# EAGLE design XuDL (EAGLE 5.11)
AUTHOR: Dave Vandenbout / XESS Corp.; DIGIKEY#: 296-16843-1-ND; MANF: Xicon; MANF#: 301-5.1K-RC; MOUSER#: 301-5.1K-RC; VERSION#: 1.0

## Sheet 1 of 2
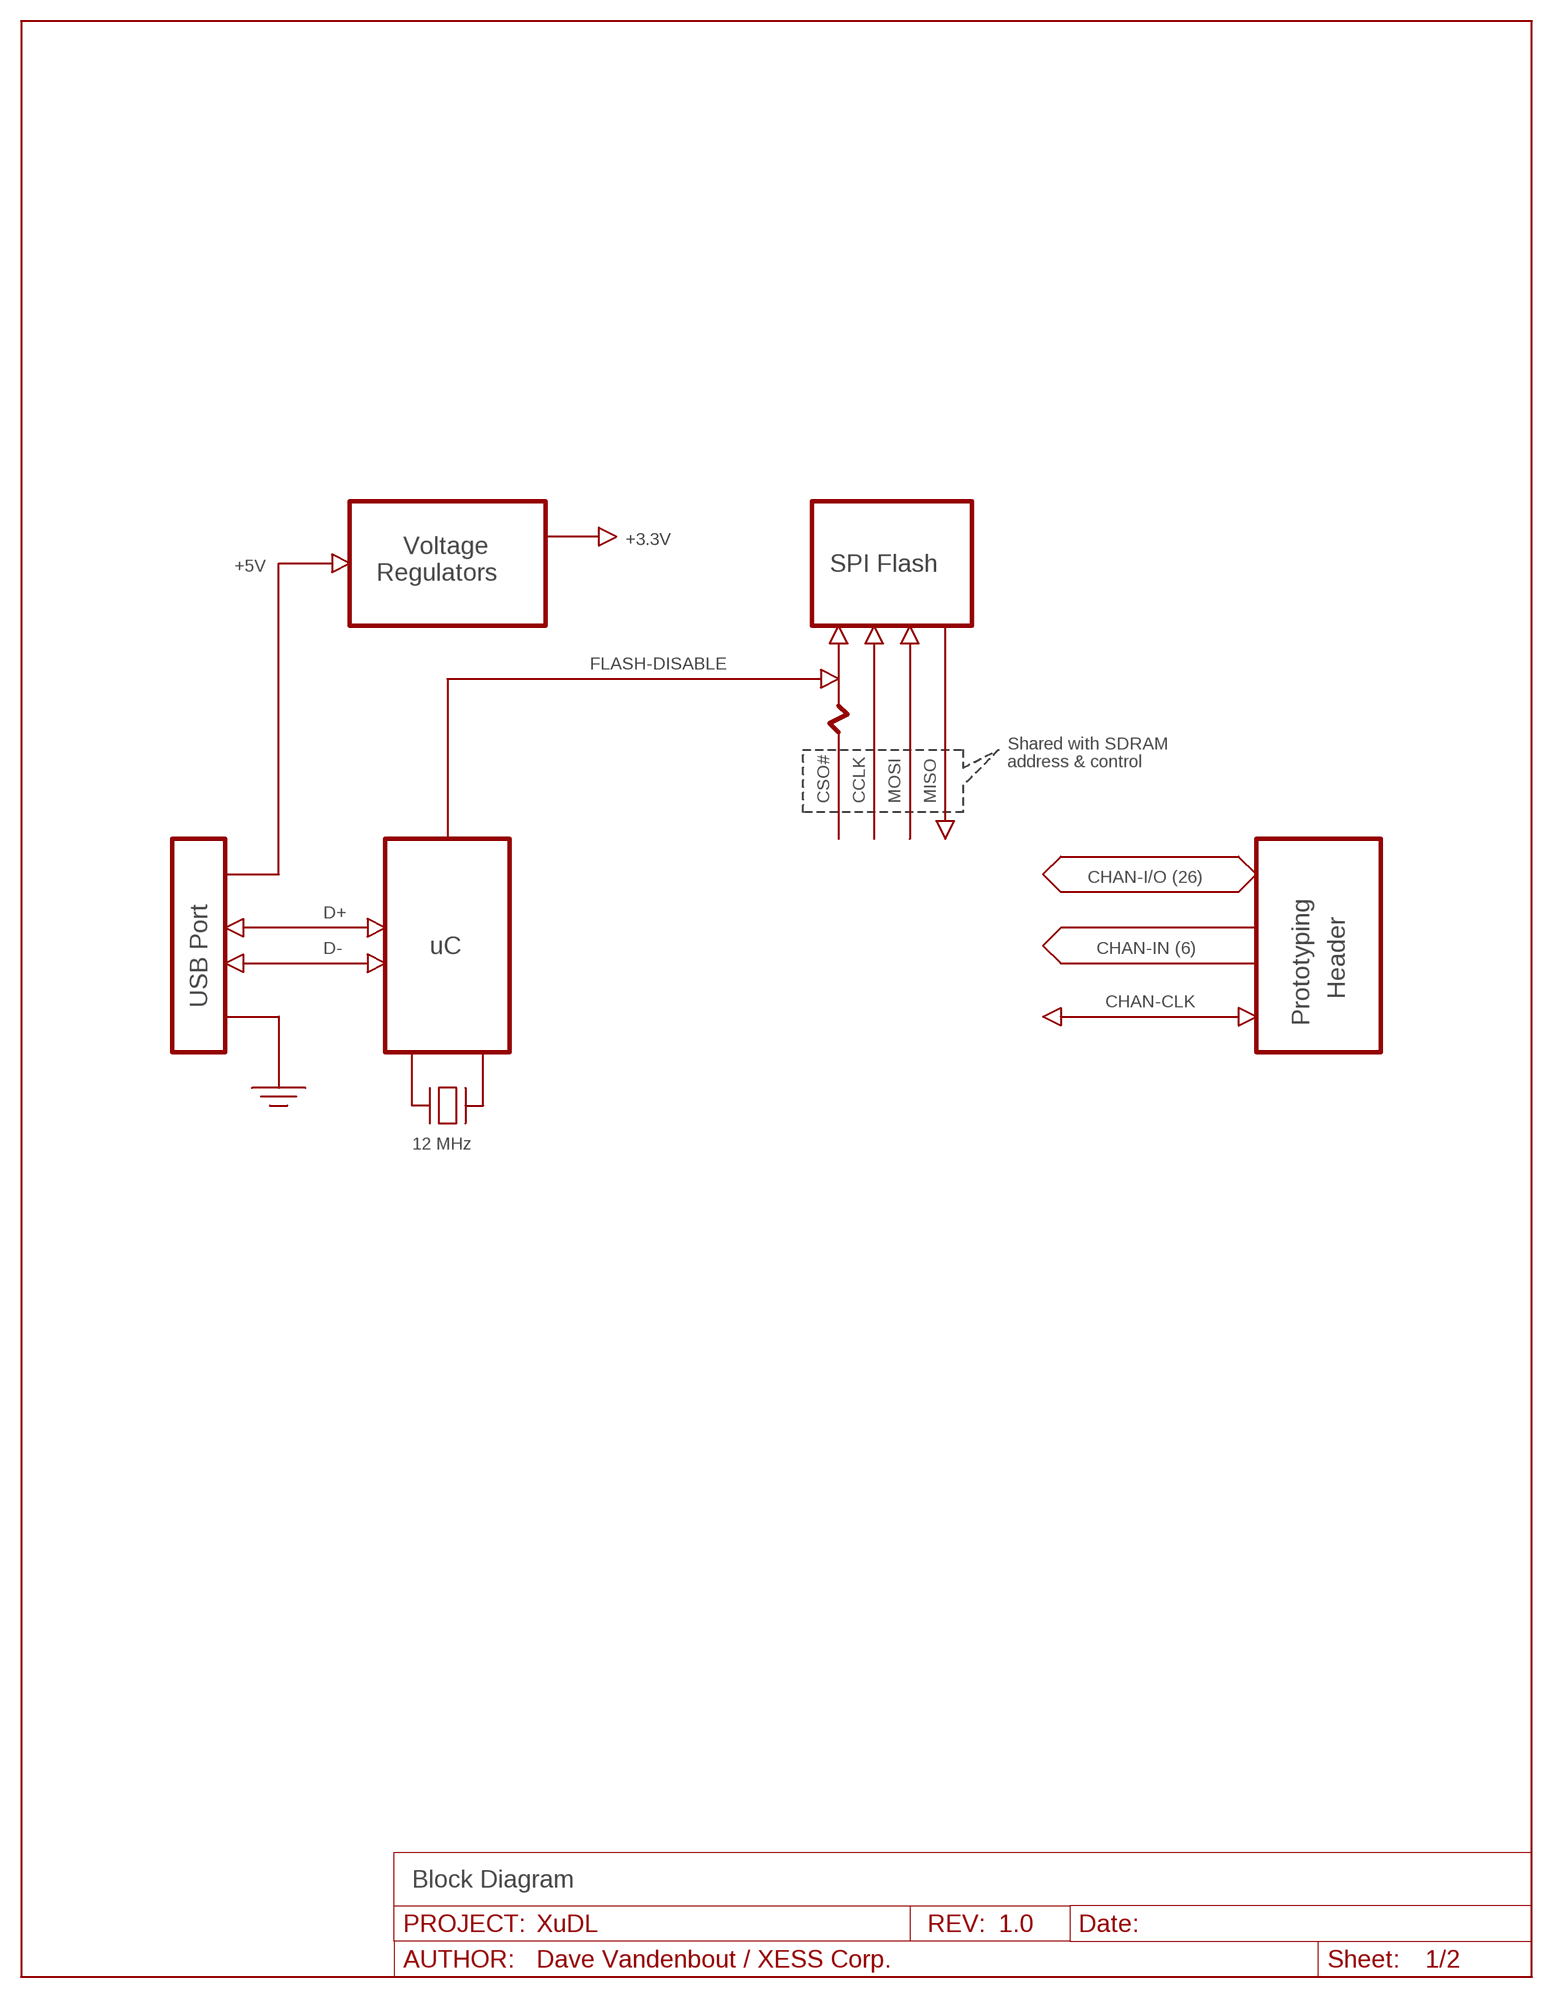
[diagram p0: schematic, sheet 1]

### Notes on the sheet
- +3.3V
- Voltage
- +5V | SPI Flash
- Regulators
- FLASH-DISABLE
- Shared with SDRAM
- address & control
- CSO# | CCLK | MOSI | MISO
- CHAN-I/O (26)
- D+
- D- | uC | CHAN-IN (6)
- Header
- USB Port | CHAN-CLK
- Prototyping
- 12 MHz
- Block Diagram

## Sheet 2 of 2
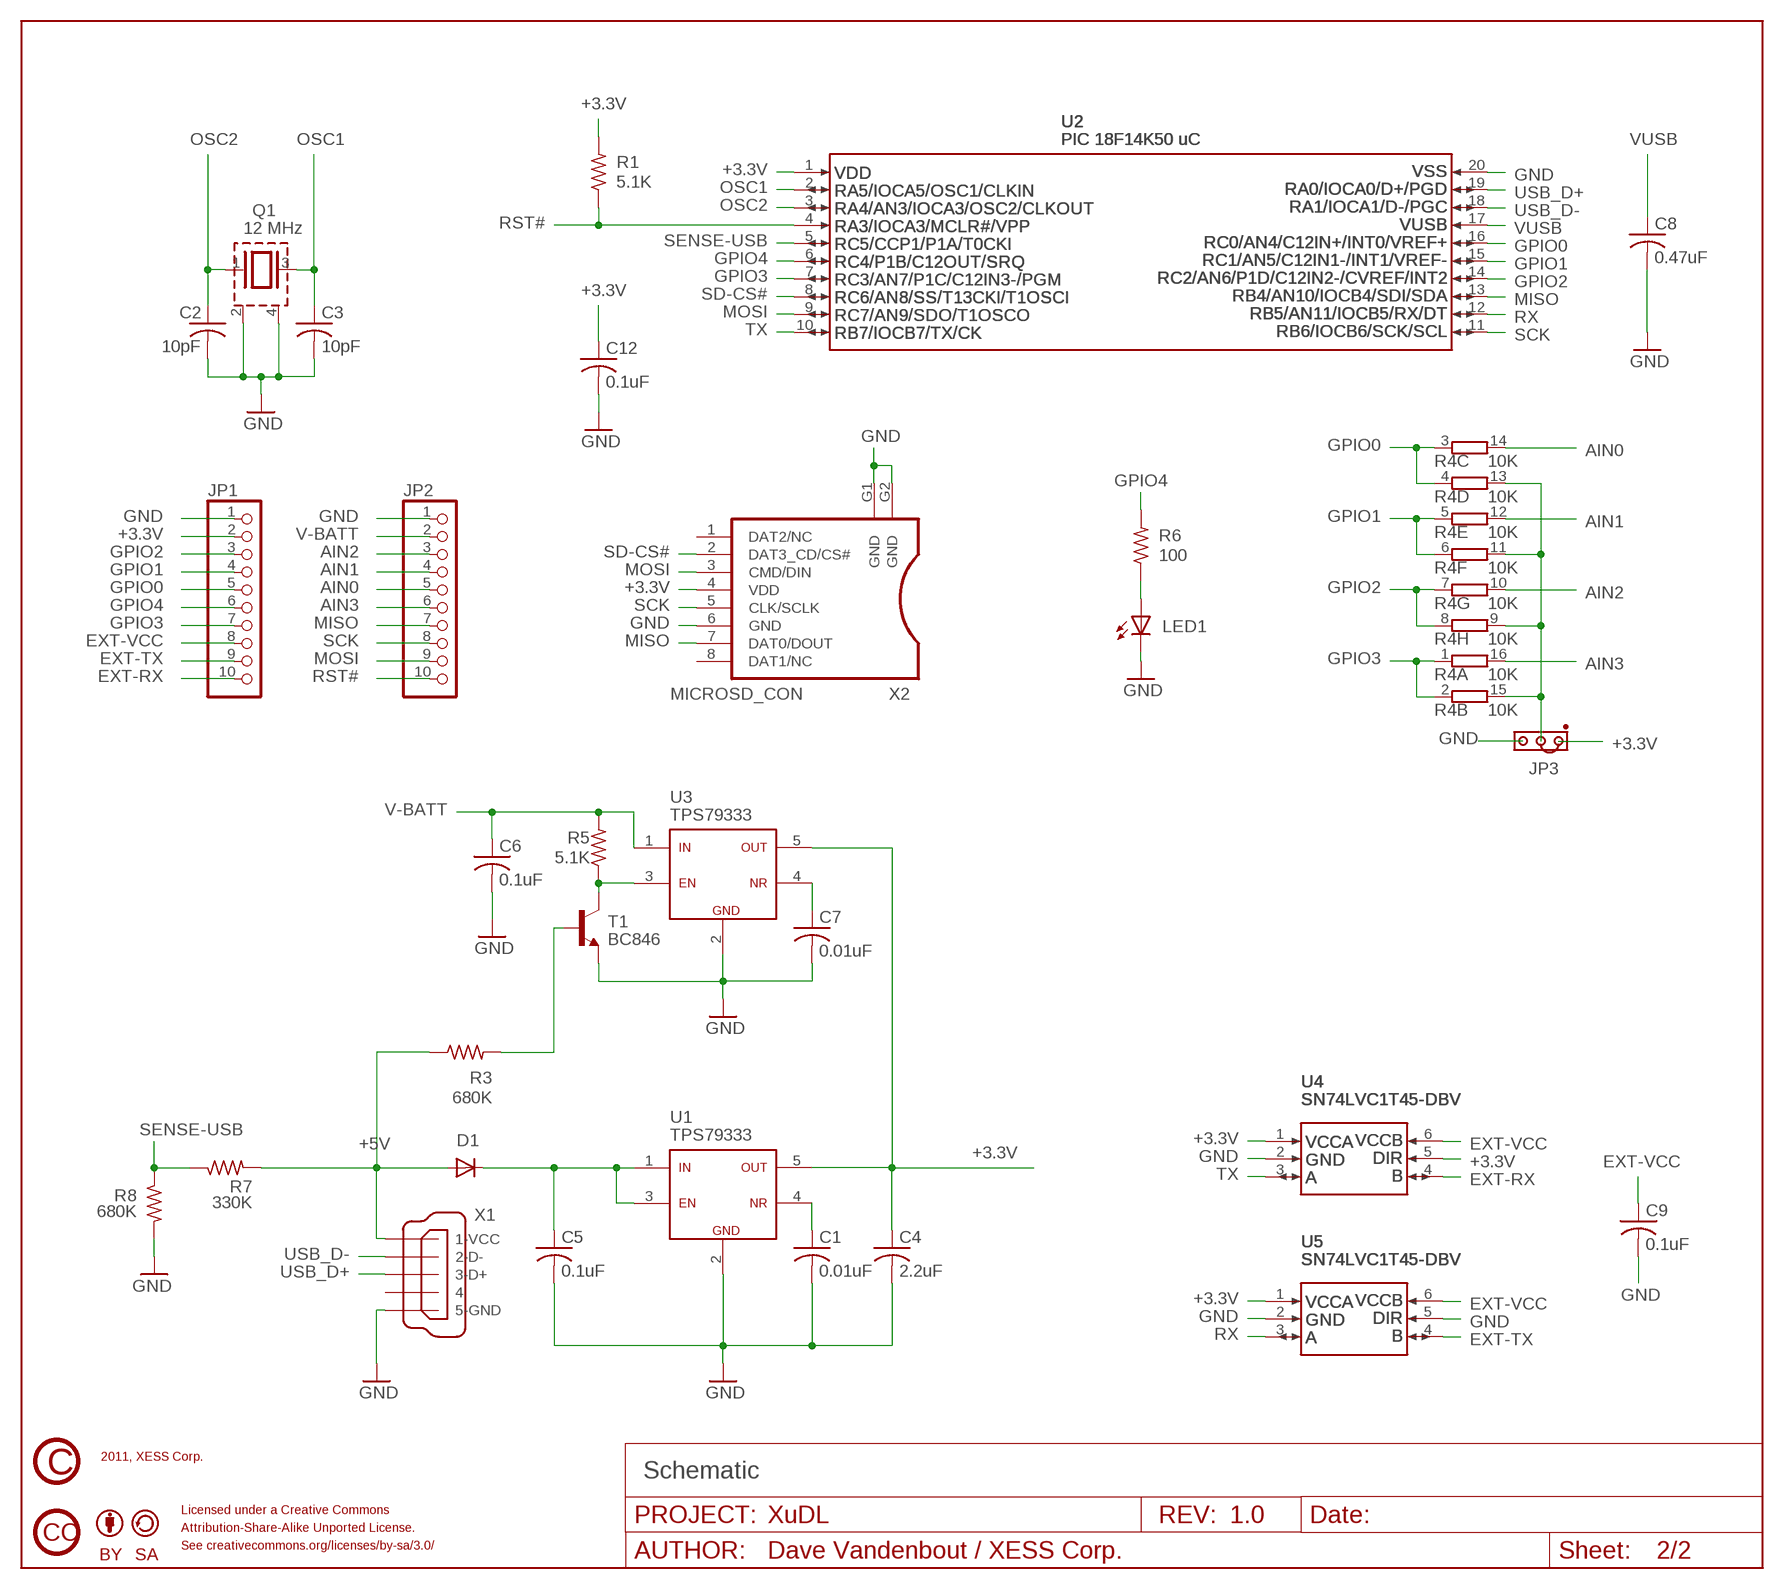
[diagram p1: schematic, sheet 2]

### Parts
C1  0.01uF  C-USC0603  [C0603]
C2  10pF  C-USC0603  [C0603]
C3  10pF  C-USC0603  [C0603]
C4  2.2uF  C-USC0603  [C0603]
C5  0.1uF  C-USC0603  [C0603]
C6  0.1uF  C-USC0603  [C0603]
C7  0.01uF  C-USC0603  [C0603]
C8  0.47uF  C-USC0603  [C0603]
C9  0.1uF  C-USC0603  [C0603]
C12  0.1uF  C-USC0603  [C0603]
D1  DIODESOD  [SOD-323]
JP1  PINHD-1X10  [1X10]
JP2  PINHD-1X10  [1X10]
JP3  JP2E  [JP2]
LED1  LED0603  [CHIPLED-0603-TTW]
Q1  12 MHz  XTAL_CHIP32X25  [32X25]
R1  5.1K  R-US_R0603  [R0603]
R3  680K  R-US_R0603  [R0603]
R4  10K  RES8741X  [741X163]
R5  5.1K  R-US_R0603  [R0603]
R6  100  R-US_R0603  [R0603]
R7  330K  R-US_R0603  [R0603]
R8  680K  R-US_R0603  [R0603]
T1  BC846  [SOT23]
U1  TPS79333  TPS793XX  [SOP5]
U2  PIC 18F14K50 uC  PIC18F14K50-I/SS  [MICROCHIP-20_SSOP]
U3  TPS79333  TPS793XX  [SOP5]
U4  SN74LVC1T45-DBV  [TI-R-PDSO-G6-DBV]
U5  SN74LVC1T45-DBV  [TI-R-PDSO-G6-DBV]
U$2  CC_CC  [CC_CC]
U$3  CC_BY  [CC_BY]
U$4  CC_SA  [CC_SA]
U$5  CC_COPYRIGHT  [CC_COPYRIGHT]
X1  MINI-USB-UX60SC-MB-5STUX60SC-MB-5ST  [UX60SC-MB-5ST]
X2  MICROSD_CON  [SCHD3A0100]

### Nets
+3.3V: C4.1 C12.1 JP1.2 JP3.1 R1.2 U1.5 U2.1 U3.5 U4.1 U4.5 U5.1 X2.4(VDD)
+5V: D1.2(A) R3.1 R7.2 X1.1(1-VCC)
AIN0: JP2.5 R4.14
AIN1: JP2.4 R4.12
AIN2: JP2.3 R4.10
AIN3: JP2.6 R4.16
EXT-RX: JP1.10 U4.4
EXT-TX: JP1.9 U5.4
EXT-VCC: C9.1 JP1.8 U4.6 U5.6
GND: C1.2 C2.2 C3.2 C4.2 C5.2 C6.2 C7.2 C8.2 C9.2 C12.2 JP1.1 JP2.1 JP3.3 LED1.C Q1.2 Q1.4 R8.2 T1.2(E) U1.2 U2.20 U3.2 U4.2 U5.2 U5.5 X1.5(5-GND) X2.6(GND) X2.G1(GND) X2.G2(GND)
GPIO0: JP1.5 R4.3 R4.4 U2.16
GPIO1: JP1.4 R4.5 R4.6 U2.15
GPIO2: JP1.3 R4.7 R4.8 U2.14
GPIO3: JP1.7 R4.1 R4.2 U2.7
GPIO4: JP1.6 R6.2 U2.6
MISO: JP2.7 U2.13 X2.7(DAT0/DOUT)
MOSI: JP2.9 U2.9 X2.3(CMD/DIN)
N$1: LED1.A R6.1
N$3: R5.1 T1.3(C) U3.3
N$4: C7.1 U3.4
N$5: R3.2 T1.1(B)
N$6: C5.1 D1.1(C) U1.1 U1.3
N$7: C1.1 U1.4
N$12: JP3.2 R4.9 R4.11 R4.13 R4.15
OSC1: C3.1 Q1.3 U2.2
OSC2: C2.1 Q1.1 U2.3
RST#: JP2.10 R1.1 U2.4
RX: U2.12 U5.3
SCK: JP2.8 U2.11 X2.5(CLK/SCLK)
SD-CS#: U2.8 X2.2(DAT3_CD/CS#)
SENSE-USB: R7.1 R8.1 U2.5
TX: U2.10 U4.3
USB_D+: U2.19 X1.3(3-D+)
USB_D-: U2.18 X1.2(2-D-)
V-BATT: C6.1 JP2.2 R5.2 U3.1
VUSB: C8.1 U2.17
Unconnected: X1.4 X2.1(DAT2/NC) X2.8(DAT1/NC)

### Notes on the sheet
- 2011, XESS Corp.
- Schematic
- Licensed under a Creative Commons
- Attribution-Share-Alike Unported License.
- See creativecommons.org/licenses/by-sa/3.0/

## Library data of the parts
C1-C9 C12 = rcl:C-US: CAPACITOR, American symbol
D1 = SparkFun:DIODE: Diode These are standard reverse protection diodes and small signal diodes. SMA package can handle up to about 1A. SOD-323 can handle about 200mA. What the SOD-323 package when ordering, there are some mfgs out there that are 5-pin packages.
JP1 JP2 = pinhead:PINHD-1X10: PIN HEADER
JP3 = xess:JP2E: JUMPER
LED1 = xess:LED: LED
Q1 = xess:XTAL_CHIP: Crystal Chip
R1 R3 R5-R8 = rcl:R-US_: RESISTOR, American symbol
R4 = xess:RES8: Resistor 8-pack Package of eight resistors.
T1 = transistor:BC846: NPN TRANSISTOR
U1 U3 = xess:TPS793XX: LDO Linear Voltage Regulator
U2 = xess:PIC18F14K50: Microchip PIC 18F14K50 Microcontroller
U4 U5 = xess:SN74LVC1T45: TI Single-Bit Dual-Supply Bus Transceiver with Configurable Voltage Translation and 3-State Outputs
U$2 = xess:CC_CC
U$3 = xess:CC_BY
U$4 = xess:CC_SA
U$5 = xess:CC_COPYRIGHT
X1 = xess:MINI-USB-: MINI USB Connector Source: http://www.hirose.co.jp/cataloge_hp/e24000019.pdf
X2 = xess:MICROSD_CON: MicroSD Card Connector

## Net classes
1 power: clearance 0.254 mm

## Board
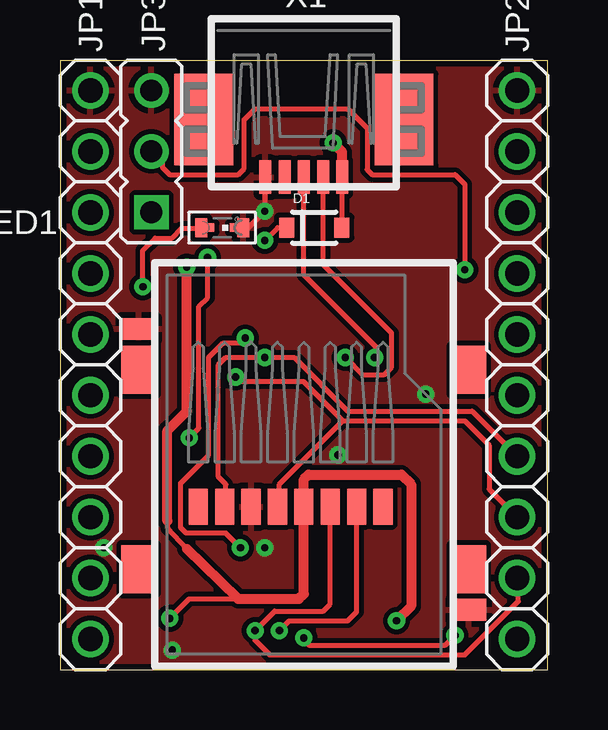
[diagram p2: board, top side]
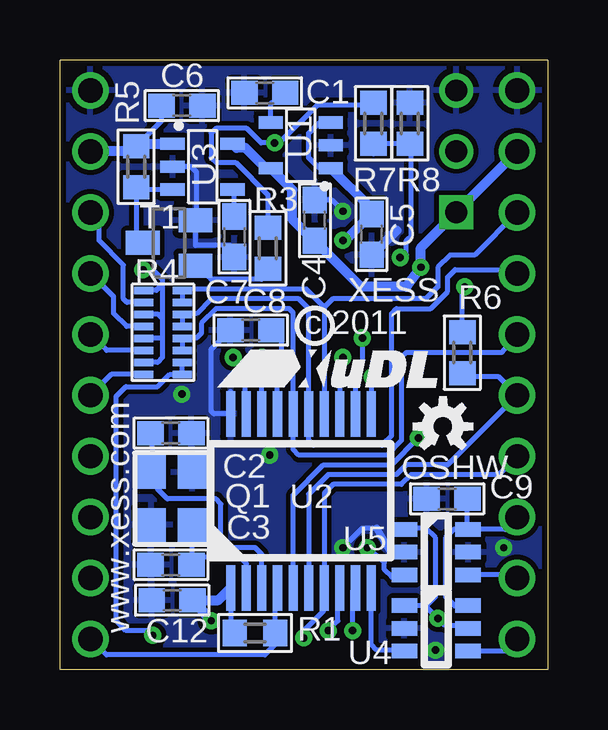
[diagram p3: board, bottom side, seen from below]

Size 20.32 x 25.4 mm. Coordinates in mm from the lower left corner, seen from the top.
Outline: 0,25.4 0,0 20.32,0 20.32,25.4 0,25.4
Copper layers (1*16): Top 0.035mm / dielectric 1.5mm / Bottom 0.035mm
Design rules "ITeadstudio_safe": minimum track width 8mil, minimum drill 12mil, track to track 8mil, track to pad 8mil, pad to pad 8mil, via to via 8mil, smd to smd 0mil, copper to edge 10mil, drill to drill 10mil, minimum pad ring 10mil, minimum via ring 8mil, stop-mask expansion 2mil, vias tented up to drill 100mil, thermal gap 10mil

### Footprints (pad centres in the part's own frame; a part is rotated, then mirrored left to right if it is on the bottom)
C0603 = smd 1.1 x 1: 1 -0.85,0; 2 0.85,0
SOD-323 = smd 0.63 x 0.83: 1 -1.15,0; 2 1.15,0
1X10 = drill 1.016 round: 1 -11.43,0; 2 -8.89,0; 3 -6.35,0; 4 -3.81,0; 5 -1.27,0; 6 1.27,0; 7 3.81,0; 8 6.35,0; 9 8.89,0; 10 11.43,0
JP2 = drill 0.914 square: 1 -2.54,0 | drill 0.914 round: 2 0,0; 3 2.54,0
CHIPLED-0603-TTW = smd 0.8 x 0.5: A 0,-0.875; C 0,0.875 | smd 0.35 x 0.35: A@1 0,-0.5; C@1 0,0.5
32X25 = smd 1.2 x 1.4: 1 0,0; 2 0,-2.2; 3 1.7,-2.2; 4 1.7,0
R0603 = smd 1 x 1.1: 1 -0.85,0; 2 0.85,0
741X163 = smd 0.3 x 0.8: 1 -1.75,-0.8; 2 -1.25,-0.8; 3 -0.75,-0.8; 4 -0.25,-0.8; 5 0.25,-0.8; 6 0.75,-0.8; 7 1.25,-0.8; 8 1.75,-0.8; 9 1.75,0.8; 10 1.25,0.8; 11 0.75,0.8; 12 0.25,0.8; 13 -0.25,0.8; 14 -0.75,0.8; 15 -1.25,0.8; 16 -1.75,0.8
SOT23 = smd 1 x 1.4: 1 -0.95,-1.1; 2 0.95,-1.1; 3 0,1.1
SOP5 = smd 1.016 x 0.508: 1 -1.25,0.95; 2 -1.25,0; 3 -1.25,-0.95; 4 1.25,-0.95; 5 1.25,0.95
MICROCHIP-20_SSOP = smd 1.89 x 0.38: 1 0,0; 2 0,-0.65; 3 0,-1.3; 4 0,-1.95; 5 0,-2.6; 6 0,-3.25; 7 0,-3.9; 8 0,-4.55; 9 0,-5.2; 10 0,-5.85; 11 7.25,-5.85; 12 7.25,-5.2; 13 7.25,-4.55; 14 7.25,-3.9; 15 7.25,-3.25; 16 7.25,-2.6; 17 7.25,-1.95; 18 7.25,-1.3; 19 7.25,-0.65; 20 7.25,0
TI-R-PDSO-G6-DBV = smd 1.05 x 0.6: 1 0,0; 2 0,-0.95; 3 0,-1.9; 4 2.65,-1.9; 5 2.65,-0.95; 6 2.65,0
UX60SC-MB-5ST = smd 1.4 x 0.5: 1 6.1,1.6; 2 6.1,0.8; 3 6.1,0; 4 6.1,-0.8; 5 6.1,-1.6 | smd 3.8 x 2.449: M1 3.7,-4.175; M2 3.7,4.175
SCHD3A0100 = smd 0.8 x 1.5: 1 3.3,-10.15; 2 2.2,-10.15; 3 1.1,-10.15; 4 0,-10.15; 5 -1.1,-10.15; 6 -2.2,-10.15; 7 -3.3,-10.15; 8 -4.4,-10.15 | smd 1.45 x 0.9: G1 6.875,-14.45; G2 -6.875,-2.75 | smd 1.45 x 2: NC1 -6.875,-4.455; NC2 -6.877,-12.752; NC3 6.871,-12.752; NC4 6.872,-4.453

### Placement (x,y rotation side)
C1  11.79,24.03 180 bottom
C2  15.7,9.86 0 bottom
C3  15.7,4.37 180 bottom
C4  9.7,18.72 90 bottom
C5  7.34,18.14 270 bottom
C6  15.24,23.5 0 bottom
C7  13.06,18.03 270 bottom
C8  12.37,14.15 180 bottom
C9  4.19,7.11 180 bottom
C12  15.65,2.9 180 bottom
D1  10.59,18.41 0 top
JP1  1.27,12.7 270 top
JP2  19.05,12.7 270 top
JP3  3.81,21.59 90 top
LED1  6.76,18.41 270 top
Q1  16.51,8.23 0 bottom
R1  12.19,1.52 180 bottom
R3  11.66,17.55 270 bottom
R4  16.03,14.05 90 bottom
R5  17.14,20.95 90 bottom
R6  3.56,13.21 270 bottom
R7  7.26,22.76 90 bottom
R8  5.74,22.76 90 bottom
T1  15.77,17.78 90 bottom
U1  10.29,21.84 180 bottom
U2  13.21,3.4 90 bottom
U3  14.38,20.95 0 bottom
U4  5.97,2.67 0 bottom
U5  5.97,5.84 0 bottom
U$2  -1.91,-15.88 0 top  (outside the outline)
U$3  5.08,-14.61 0 top  (outside the outline)
U$4  10.16,-14.61 0 top  (outside the outline)
U$5  -1.91,-6.99 0 top  (outside the outline)
X1  10.16,26.62 270 top
X2  10.16,16.94 0 top

### Tracks (layer width: path | path; a pad name or v marks a point on that pad's centre or on a via)
+3.3V  (via drill 0.3)
  Top 0.203: 7.42,2.95 5.38,2.95 v4.57,2.13 | 5.28,5.03 4.5,5.89 4.47,6.2
  Top 0.406: v14.02,2.03 14.63,2.64 14.63,7.72 14.22,8.13 10.36,8.13 10.16,7.92 X2.4 10.16,3.15 9.96,2.95 7.42,2.95 5.28,5.03 | 4.47,6.2 4.47,9.96 5.28,10.77 v5.28,16.76
  Bottom 0.203: 5.11,2.67 U4.1 | 5.11,2.67 v4.57,2.13 4.27,1.83 3.43,1.83 U4.5 | R1.2 13.04,1.66 13.21,1.83 U2.1 | 5.11,2.67 5.05,2.67 4.67,3.05 4.67,5.49 5.08,5.89 5.92,5.89 U5.1
  Bottom 0.406: JP1.2 JP3.1 5.28,17.58 v5.28,16.76 5.89,15.95 7.78,15.95 C4.1 9.74,17.87 10.64,18.77 10.64,19.99 11.38,20.73 11.38,20.74 U1.5 11.75,20.89 12.6,21.74 12.96,21.74 U3.5 | U2.1 13.72,2.9 C12.1 14.63,2.73 v14.02,2.03
+5V  (via drill 0.3)
  Top 0.203: X1.1 11.76,18.43 D1.2
  Top 0.406: X1.1 11.76,21.57 v11.38,21.95
  Bottom 0.203: R7.2 7.33,23.55 9.58,23.55 11.18,21.95 v11.38,21.95 11.94,21.95 12.55,22.55 13.82,22.55 14.02,22.35 14.02,21.34 13.82,21.13 13.01,21.13 11.66,19.79 R3.1
AIN0
  Bottom 0.203: R4.14 18.38,13.3 JP2.5
AIN1
  Bottom 0.203: R4.12 17.55,14.3 18.09,14.83 18.09,15.54 JP2.4
AIN2
  Bottom 0.203: R4.10 17.53,15.3 17.68,15.44 17.68,16.87 18.69,17.88 18.69,18.69 JP2.3
AIN3
  Bottom 0.203: R4.16 18.18,12.3 JP2.6
EXT-RX
  Bottom 0.203: U4.4 1.77,0.77 JP1.10
EXT-TX
  Bottom 0.203: U5.4 1.4,3.94 JP1.9
EXT-VCC
  Bottom 0.203: U5.6 1.78,5.84 JP1.8 | C9.1 3.34,5.86 U5.6 | U5.6 3.91,5.84 4.27,5.49 4.27,3.05 3.86,2.64 3.34,2.64 U4.6
GND  (via drill 0.3)
  Top 0.203: X1.5 8.56,19.28 v8.53,19.1 7.85,18.41 LED1.C
  Bottom 0.203: U3.2 14.86,20.95 14.63,20.73 14.63,19.1 T1.2 | T1.2 14.5,18.73 | 13.21,11.58 U2.20 13.9,10.65 14.02,10.77 14.02,13.35 C8.2 | U5.2 6.49,4.82 | 7.11,5.89 7.72,5.89 v8.53,5.08 | C4.2 9,19.57 v8.53,19.1 | C7.2 12.92,17.18 13.21,17.68 14.67,17.68 T1.2
  Bottom 0.305: 6.49,4.82 7.11,5.89
  Bottom 0.406: C5.2 7.3,17.29 6.3,18.29
  other vias: 4.67,0.81 1.83,5.08 15.24,11.48 11.58,8.94
  pour Top: 0,25.4 0,0 20.32,0 20.32,25.4
  pour Bottom (rank 2): 0,25.4 0,0 20.32,0 20.32,25.4
GPIO0
  Bottom 0.203: R4.3 R4.4 15.21,13.82 14.63,13.82 14.43,14.02 14.43,14.43 13.82,15.04 10.77,15.04 10.61,14.88 U2.16 10.61,9.19 10.36,8.94 6.71,8.94 6.1,9.55 6.1,13.01 5.89,13.21 1.93,13.21 JP1.5
GPIO1
  Bottom 0.203: R4.5 R4.6 15.19,14.83 14.63,14.83 14.02,15.44 10.36,15.44 9.96,15.04 U2.15 9.96,9.55 9.75,9.35 6.91,9.35 6.5,9.75 6.5,14.83 6.3,15.04 4.88,15.04 4.17,15.75 4.17,16.36 3.86,16.66 1.32,16.66 JP1.4
GPIO2
  Bottom 0.203: 9.31,15.1 U2.14 | 9.31,15.1 10.06,15.85 15.17,15.85 R4.8 R4.7 | 9.31,15.1 8.96,15.44 5.08,15.44 4.57,15.95 4.57,16.76 4.06,17.27 3.05,17.27 JP1.3 1.32,19
GPIO3  (via drill 0.3)
  Top 0.203: v16.46,1.42 16.05,1.02 10.36,1.02 v10.16,1.32
  Bottom 0.203: R4.2 R4.1 15.74,12.3 16.26,11.79 17.58,11.79 17.98,11.38 17.98,2.03 17.58,1.63 16.66,1.63 v16.46,1.42 | JP1.7 2.03,8.13 5.69,8.13 6.1,7.72 8.94,7.72 9.31,7.35 U2.7 9.35,3.36 9.35,2.44 10.16,1.63 v10.16,1.32
GPIO4
  Bottom 0.203: U2.6 9.96,7.31 9.14,8.13 6.3,8.13 5.89,8.53 4.17,8.53 JP1.6 2.03,12.19 3.39,12.19 R6.2
MISO  (via drill 0.3)
  Top 0.203: X2.7 6.91,6.84 6.91,7.72 6.6,8.03 6.6,12.7 6.91,13.01 v8.53,13.01 9.75,13.01 11.99,10.77 17.17,10.77 JP2.7
  Bottom 0.203: U2.13 8.66,12.88 v8.53,13.01
MOSI  (via drill 0.3)
  Top 0.203: X2.3 11.26,2.73 10.97,2.44 8.94,2.44 v8.13,1.63 8.13,1.22 8.74,0.61 16.87,0.61 19.1,2.85 19.1,3.76 JP2.9
  Bottom 0.203: v8.13,1.63 8.13,3.28 U2.9
N$1  (via drill 0.3)
  Top 0.203: v3.45,15.95 3.45,17.48 3.96,17.98 4.67,17.98 5.08,18.39 6.26,18.39 LED1.A
  Bottom 0.203: R6.1 3.56,15.85 v3.45,15.95
N$3
  Bottom 0.203: U3.3 17.05,20 R5.1 17.14,18.25 T1.3
N$4
  Bottom 0.203: C7.1 13.06,19.87 U3.4
N$5
  Bottom 0.203: T1.1 14.02,16.26 11.93,16.26 R3.2
N$6  (via drill 0.3)
  Top 0.203: D1.1 9.07,18.41 v8.53,17.88
  Bottom 0.203: U1.3 9.52,22.79 9.96,22.35 9.96,21.34 9.55,20.93 9.07,20.93 U1.1 | C5.1 7.4,18.99 | 8.45,17.88 v8.53,17.88
  Bottom 0.406: C5.1 8.45,17.88 | 7.4,18.99 7.4,19.26 U1.1
N$7
  Bottom 0.203: U1.4 11.54,23.6 C1.1
N$12  (via drill 0.3)
  Top 0.203: v16.87,16.66 16.87,20.22 16.46,20.62 13.01,20.62 12.8,20.83 12.8,22.55 11.99,23.37 8.13,23.37 7.67,22.91 7.67,20.88 7.42,20.62 4.57,20.62 4.27,20.93 4.27,21.13 JP3.2
  Bottom 0.203: v16.87,16.66 16.46,16.66 16.05,16.26 16.05,16.05 | 16.05,16.05 16.05,14.63 | 16.05,14.63 16.05,13.82 | 16.05,13.82 16.05,13.01 16.26,12.8 R4.15 | R4.13 16.07,13.8 16.05,13.82 | R4.11 16.22,14.8 16.05,14.63 | R4.9 16.31,15.8 16.05,16.05
OSC1
  Bottom 0.203: U2.2 12.56,4.43 12.8,4.67 14.54,4.67 C3.1 | C3.1 14.61,4.61 | Q1.3 14.81,4.41 C3.1
OSC2
  Bottom 0.203: C2.1 16.34,8.27 Q1.1 16.26,8.18 16.26,7.52 15.85,7.11 13.82,7.11 13.61,6.91 13.61,5.28 13.41,5.08 12.19,5.08 11.91,4.8 U2.3
RST#
  Bottom 0.203: JP2.10 18.39,0.61 11.79,0.61 11.34,1.05 R1.1 11.34,3.32 U2.4
RX  (via drill 0.3)
  Top 0.203: v7.72,13.82 7.52,13.61 6.81,13.61 6.2,13.01 6.2,8.94 5.03,7.77 5.03,5.92 5.26,5.69 6.91,5.69 v7.52,5.08
  Bottom 0.203: U2.12 8.01,12.52 7.72,12.8 v7.72,13.82 | v7.52,5.08 6.81,4.47 6.81,4.17 6.5,3.86 6.05,3.86 U5.3
SCK  (via drill 0.3)
  Top 0.203: JP2.8 17.88,7.52 17.88,9.35 16.87,10.36 11.79,10.36 | 11.79,10.36 10.16,11.99 7.32,11.99 v7.32,12.19 | X2.5 9.14,6.79 9.14,7.72 11.79,10.36
  Bottom 0.203: U2.11 7.36,11.95 v7.32,12.19
SD-CS#  (via drill 0.3)
  Top 0.203: X2.2 12.36,2.4 11.99,2.03 9.55,2.03 v9.14,1.63
  Bottom 0.203: v9.14,1.63 8.74,2.03 8.74,3.32 U2.8
SENSE-USB  (via drill 0.3)
  Top 0.203: v6.15,17.17 6.15,15.49 5.79,15.14 5.79,10.06 v5.38,9.65
  Bottom 0.203: 7.26,21.49 R7.1 R8.1 5.69,21.86 5.69,18.09 5.89,17.88 5.89,17.27 6.15,17.22 v6.15,17.17 | U2.5 10.61,7.27 9.35,8.53 6.5,8.53 v5.38,9.65
TX
  Bottom 0.203: U2.10 7.36,1.06 7.11,0.81 6.01,0.81 U4.3
USB_D+  (via drill 0.3)
  Top 0.203: X1.3 10.16,16.46 13.21,13.41 13.21,13.11 v13.11,13.01
  Bottom 0.203: v13.11,13.01 12.6,12.5 12.6,10.69 U2.19
USB_D-  (via drill 0.3)
  Top 0.203: X1.2 10.97,20.51 10.97,16.87 13.82,14.02 13.82,12.6 13.51,12.29 12.6,12.29 v11.89,13.01
  Bottom 0.203: U2.18 11.91,12.92 v11.89,13.01
V-BATT
  Bottom 0.203: R5.2 17.05,21.91 | R5.2 17.36,21.59 | C6.1 16.09,22.86 R5.2
  Bottom 0.406: 17.05,21.91 U3.1 | 17.36,21.59 JP2.2
VUSB
  Bottom 0.203: U2.17 11.26,11.8 11.07,11.99 11.07,13.7 C8.1

### Text on the board
bPlace: XESS | c 2011 | www.xess.com | OSHW
tDocu: GND | GND | +3.3V | V-BATT | GPIO2 | AIN2 | GPIO1 | AIN1 | GPIO0 | AIN0 | GPIO4 | AIN3 | GPIO3 | MISO | EXT-VCC | SCK | EXT-TX | MOSI | EXT-RX | RST# | 2011, XESS Corp. | Licensed under a Creative Commons | Attribution-Share-Alike Unported License. | See creativecommons.org/licenses/by-sa/3.0/